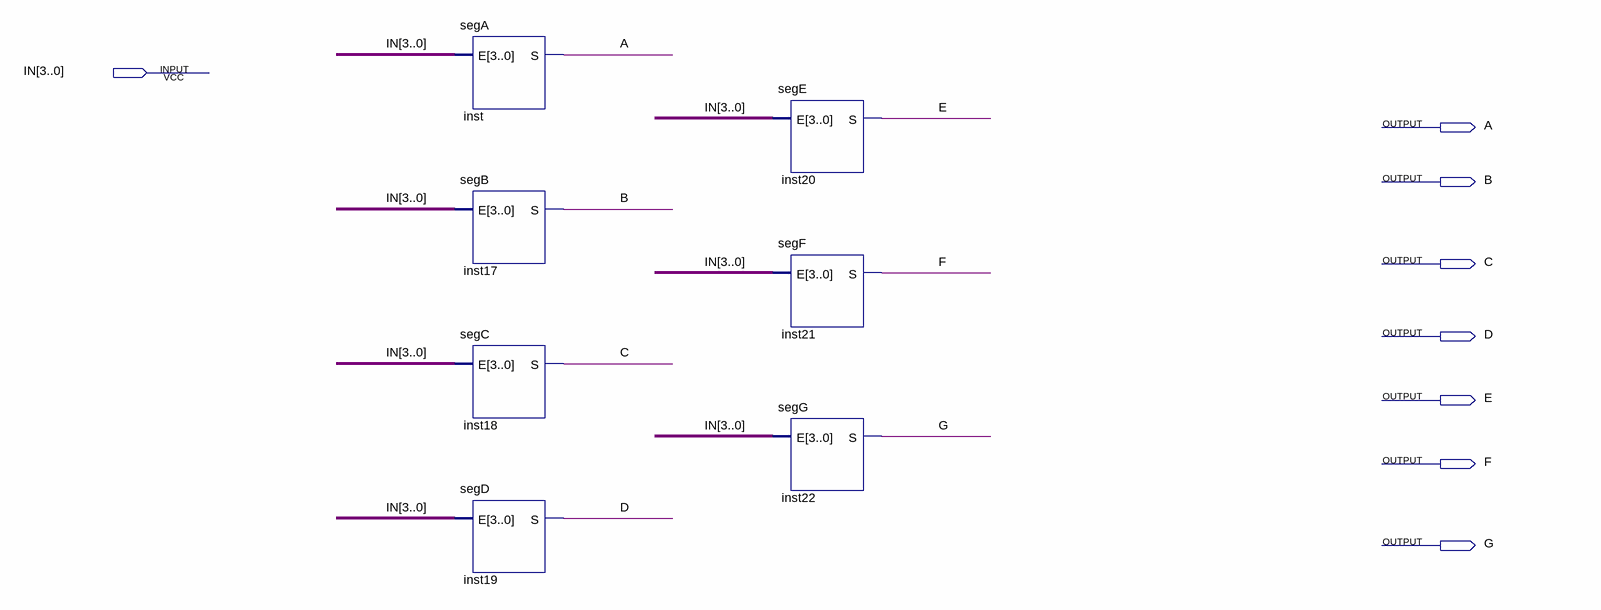
[diagram p0: schematic sheet]
// Quartus schematic converter.bdf as structural Verilog: 7 symbols, 8 pins
module converter (
  input  [3:0] IN,
  output A,
  output B,
  output C,
  output D,
  output E,
  output F,
  output G
);

  segA inst (.E(IN), .S(A));
  segB inst17 (.E(IN), .S(B));
  segC inst18 (.E(IN), .S(C));
  segD inst19 (.E(IN), .S(D));
  segE inst20 (.E(IN), .S(E));
  segF inst21 (.E(IN), .S(F));
  segG inst22 (.E(IN), .S(G));
endmodule
